# EAGLE design cpx-synth1-jacks (EAGLE 8.6.3)
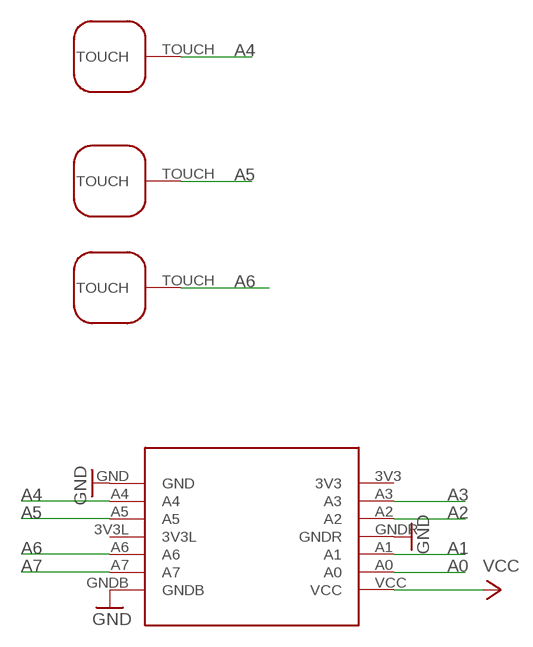
[diagram p0: schematic, sheet 1]

## Parts
T1  TOUCHPADROUND1  [TOUCHPAD1]
T2  TOUCHPADROUND1  [TOUCHPAD1]
T3  TOUCHPADROUND1  [TOUCHPAD1]
U1  CIRCUITPLAYGROUNDEXPRESS  [CIRCUITPLAYGROUNDEXPRESS]

## Nets
A0: U1.A0
A1: U1.A1
A2: U1.A2
A3: U1.A3
A4: T3.TOUCH U1.A4
A5: T2.TOUCH U1.A5
A6: T1.TOUCH U1.A6
A7: U1.A7
GND: U1.GND U1.GNDB U1.GNDR
VCC: U1.VCC
Unconnected: U1.3V3 U1.3V3L

## Library data of the parts
T1-T3 = todstuff:TOUCHPAD
U1 = todstuff:CIRCUITPLAYGROUNDEXPRESS

## Board
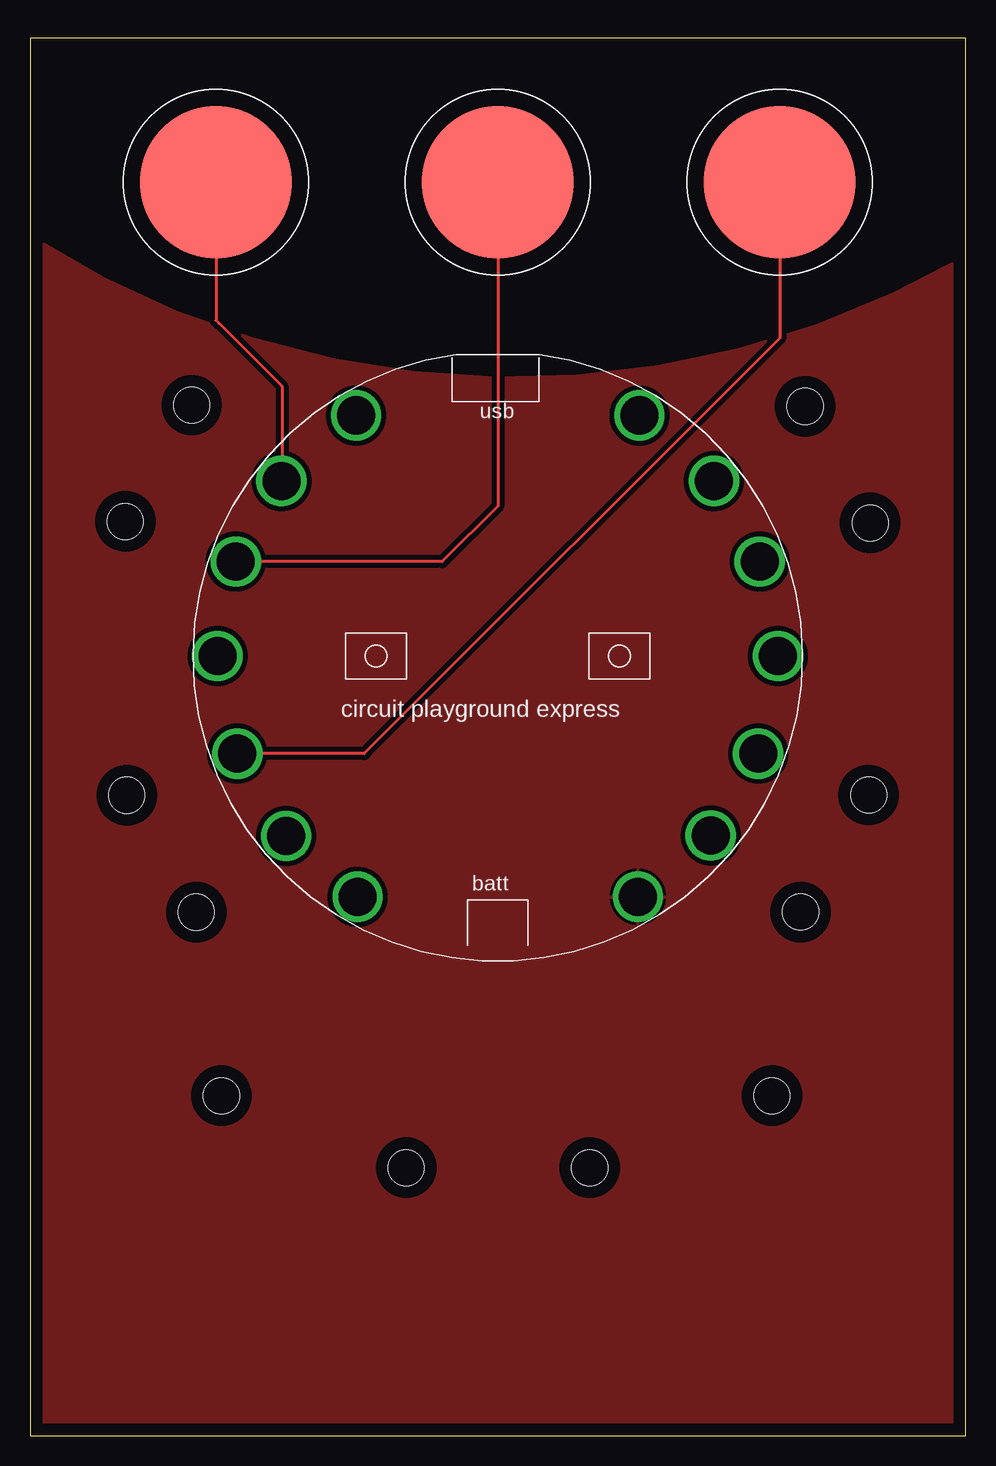
[diagram p1: board, top side]
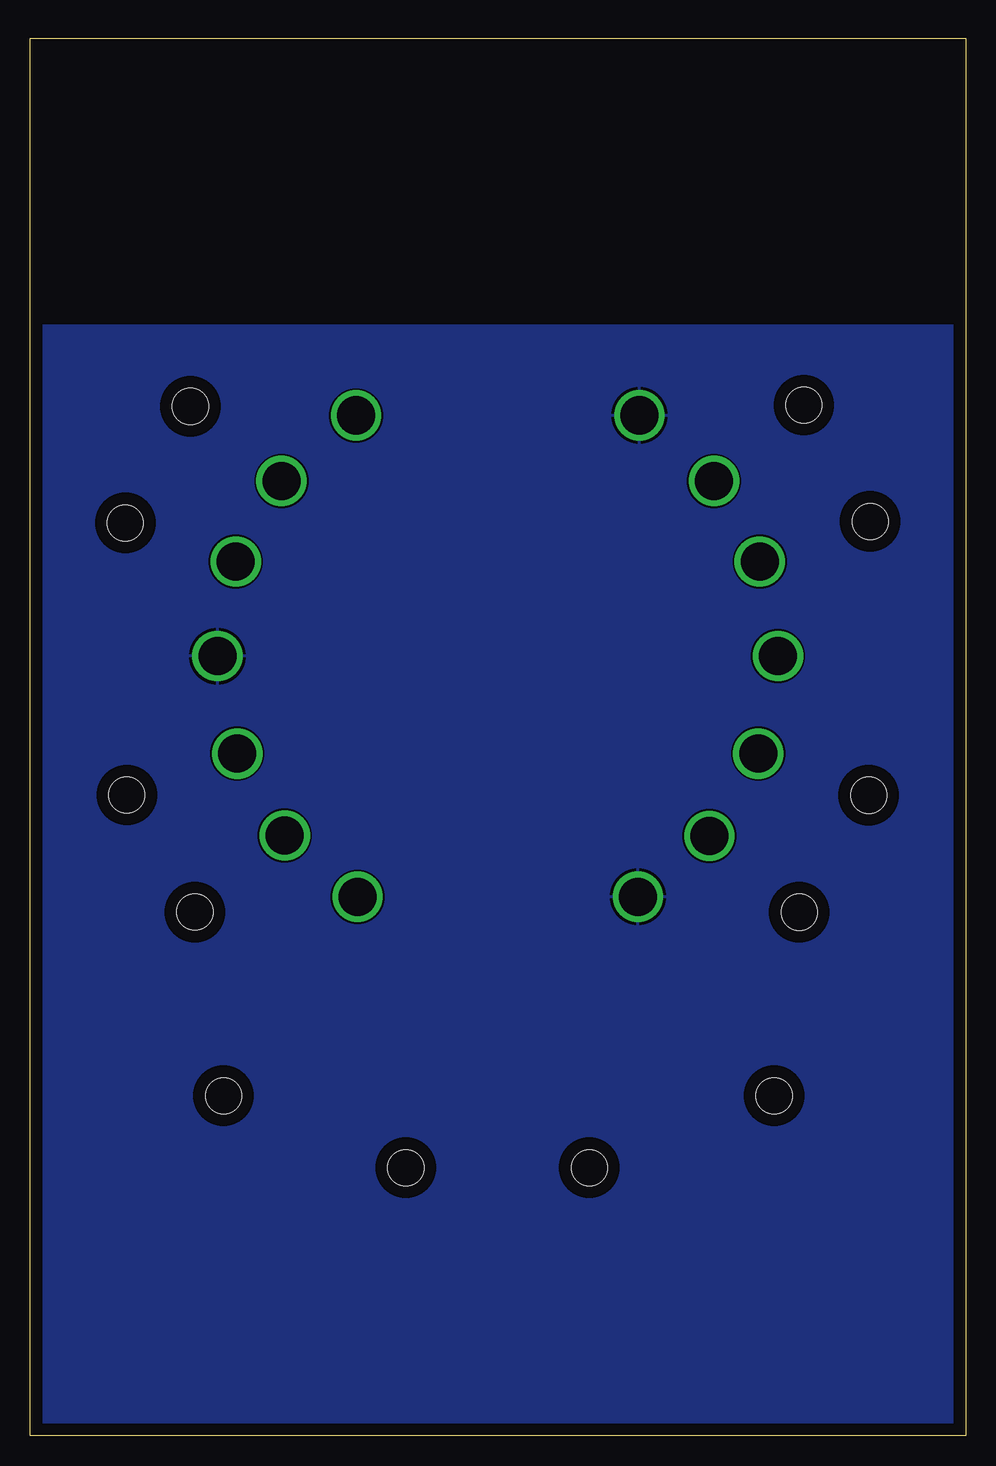
[diagram p2: board, bottom side, seen from below]

Size 78 x 116.5 mm. Coordinates in mm from the lower left corner, seen from the top.
Outline: 0,0 78,0 78,116.5 0,116.5 0,0
Copper layers (1*16): Top 0.035mm / dielectric 1.5mm / Bottom 0.035mm
Design rules "default": minimum track width 6mil, minimum drill 0.35mm, track to track 6mil, track to pad 6mil, pad to pad 6mil, via to via 6mil, smd to smd 6mil, copper to edge 40mil, drill to drill 6mil, minimum pad ring 10mil, minimum via ring 8mil, stop-mask expansion 4mil, vias tented up to drill 0mil, thermal gap 10mil
Holes 3 mm at 13.48,85.92 7.95,76.22 8.07,53.4 13.86,43.64 64.26,43.66 69.93,53.42 70.05,76.09 64.62,85.82 15.96,28.34 31.36,22.34 46.66,22.34 61.86,28.34

### Footprints (pad centres in the part's own frame; a part is rotated, then mirrored left to right if it is on the bottom)
TOUCHPAD1 = smd 12.7 x 12.7: TOUCH 0,0
CIRCUITPLAYGROUNDEXPRESS = drill 3.175: 3V3 11.811,20.066; 3V3L -23.368,0; A0 17.755,-14.961; A1 21.717,-8.128; A2 21.844,7.874; A3 18.034,14.605; A4 -18.034,14.605; A5 -21.844,7.874; A6 -21.717,-8.128; A7 -17.653,-14.986; GND -11.811,20.066; GNDB -11.684,-20.066; GNDR 23.368,0; VCC 11.684,-20.066

### Placement (x,y rotation side)
T1  62.5,104.5 0 top
T2  39,104.5 0 top
T3  15.5,104.5 0 top
U1  39,65 0 top

### Tracks (layer width: path | path; a pad name or v marks a point on that pad's centre or on a via)
A4
  Top 0.254: T3.TOUCH 15.5,93 15.75,92.75 21,87.5 21,79.64 U1.A4
A5
  Top 0.254: T2.TOUCH 39,77.5 34.37,72.87 U1.A5
A6
  Top 0.254: T1.TOUCH 62.5,91.5 27.87,56.87 U1.A6
GND
  pour Bottom: -2,92.5 80,92.5 80,-4 -2,-4
VCC
  pour Top (isolate 0.406): 0,100 arc63 78.06,98.36 78.76,-2.46 -0.76,-0.96